# Altium schematic sheet 信号输入模块.SchDoc
size A3
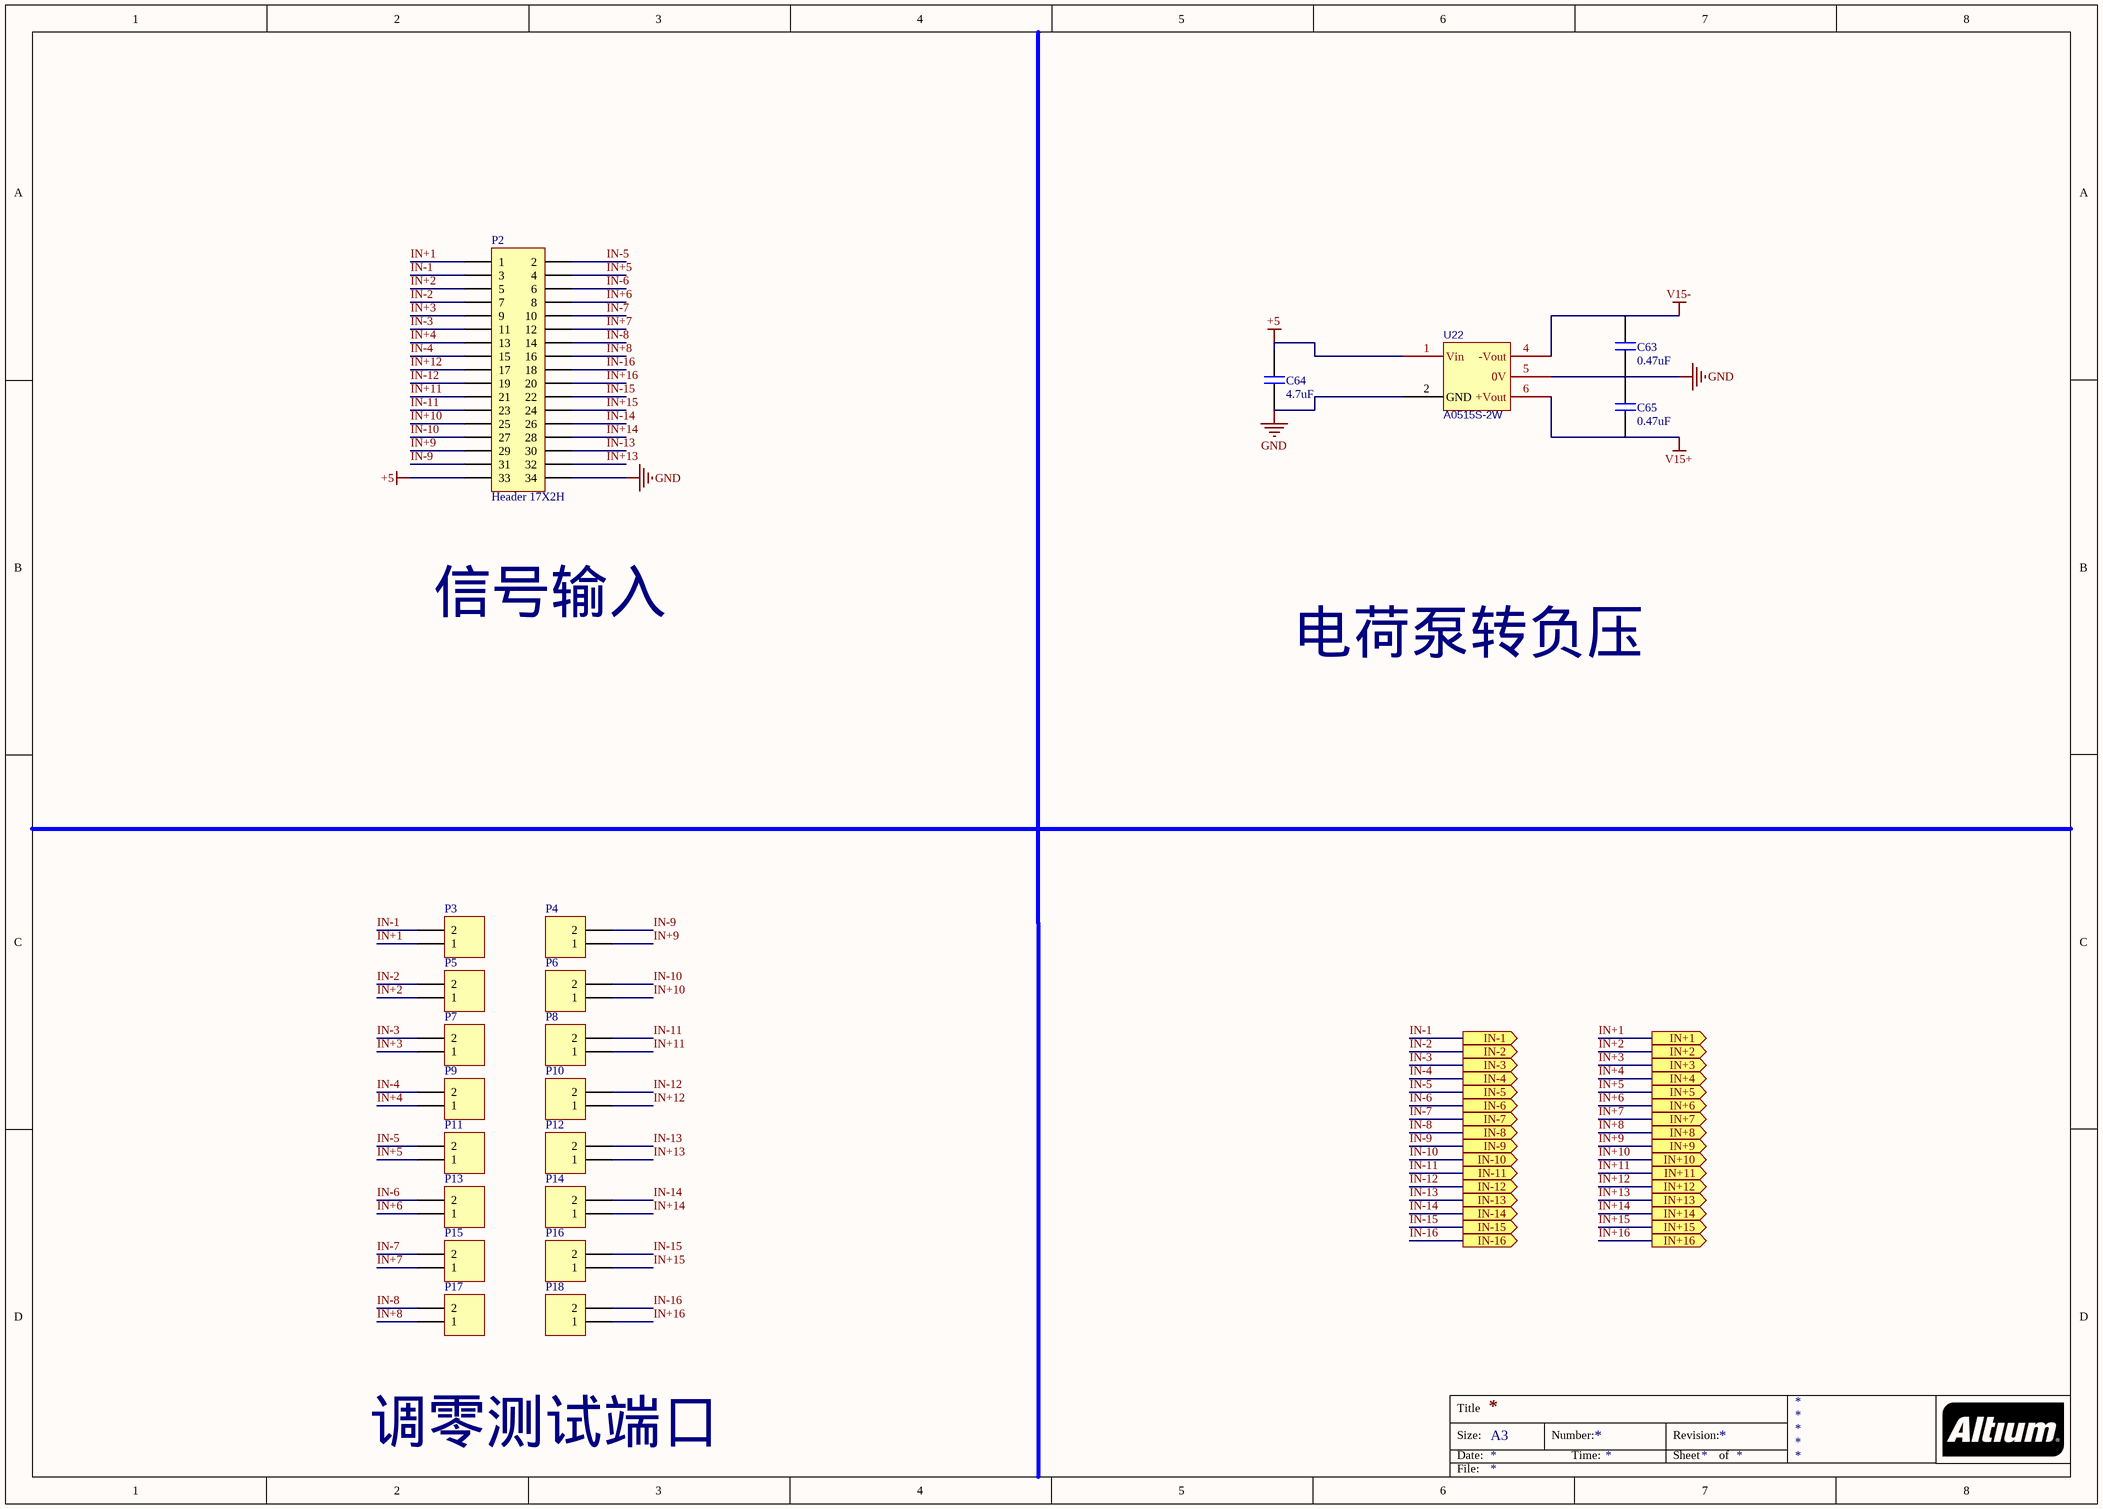
[diagram p0: 信号输入模块.SchDoc]

## Parts
C63  0.47uF  [0805C]
C64  4.7uF  [0805C]
C65  0.47uF  [0805C]
P2  Header 17X2H  [HDR2X17]
P3  Header 2H  [HDR-SMD_2P-P2.54-V-M-S4.8]  (value not drawn)
P4  Header 2H  [HDR-SMD_2P-P2.54-V-M-S4.8]  (value not drawn)
P5  Header 2H  [HDR-SMD_2P-P2.54-V-M-S4.8]  (value not drawn)
P6  Header 2H  [HDR-SMD_2P-P2.54-V-M-S4.8]  (value not drawn)
P7  Header 2H  [HDR-SMD_2P-P2.54-V-M-S4.8]  (value not drawn)
P8  Header 2H  [HDR-SMD_2P-P2.54-V-M-S4.8]  (value not drawn)
P9  Header 2H  [HDR-SMD_2P-P2.54-V-M-S4.8]  (value not drawn)
P10  Header 2H  [HDR-SMD_2P-P2.54-V-M-S4.8]  (value not drawn)
P11  Header 2H  [HDR-SMD_2P-P2.54-V-M-S4.8]  (value not drawn)
P12  Header 2H  [HDR-SMD_2P-P2.54-V-M-S4.8]  (value not drawn)
P13  Header 2H  [HDR-SMD_2P-P2.54-V-M-S4.8]  (value not drawn)
P14  Header 2H  [HDR-SMD_2P-P2.54-V-M-S4.8]  (value not drawn)
P15  Header 2H  [HDR-SMD_2P-P2.54-V-M-S4.8]  (value not drawn)
P16  Header 2H  [HDR-SMD_2P-P2.54-V-M-S4.8]  (value not drawn)
P17  Header 2H  [HDR-SMD_2P-P2.54-V-M-S4.8]  (value not drawn)
P18  Header 2H  [HDR-SMD_2P-P2.54-V-M-S4.8]  (value not drawn)
U22  A0515S-2W  [PWRM-TH_AXXXXS-2W]

## Ports
IN+1 (out), IN+2 (out), IN+3 (out), IN+4 (out), IN+5 (out), IN+6 (out), IN+7 (out), IN+8 (out), IN+9 (out), IN+10 (out), IN+11 (out), IN+12 (out), IN+13 (out), IN+14 (out), IN+15 (out), IN+16 (out), IN-1 (out), IN-2 (out), IN-3 (out), IN-4 (out), IN-5 (out), IN-6 (out), IN-7 (out), IN-8 (out), IN-9 (out), IN-10 (out), IN-11 (out), IN-12 (out), IN-13 (out), IN-14 (out), IN-15 (out), IN-16 (out)

## Nets
+5: C64.2 P2.33 U22.1(Vin)
GND: C63.1 C64.1 C65.2 P2.34 U22.2(GND) U22.5(0V)
V15+: C65.1 U22.6(+Vout)
V15-: C63.2 U22.4(-Vout)
IN+1: P2.1 P3.1 ; port IN+1
IN+2: P2.5 P5.1 ; port IN+2
IN+3: P2.9 P7.1 ; port IN+3
IN+4: P2.13 P9.1 ; port IN+4
IN+5: P2.4 P11.1 ; port IN+5
IN+6: P2.8 P13.1 ; port IN+6
IN+7: P2.12 P15.1 ; port IN+7
IN+8: P2.16 P17.1 ; port IN+8
IN+9: P2.29 P4.1 ; port IN+9
IN+10: P2.25 P6.1 ; port IN+10
IN+11: P2.21 P8.1 ; port IN+11
IN+12: P2.17 P10.1 ; port IN+12
IN+13: P2.32 P12.1 ; port IN+13
IN+14: P2.28 P14.1 ; port IN+14
IN+15: P2.24 P16.1 ; port IN+15
IN+16: P2.20 P18.1 ; port IN+16
IN-1: P2.3 P3.2 ; port IN-1
IN-2: P2.7 P5.2 ; port IN-2
IN-3: P2.11 P7.2 ; port IN-3
IN-4: P2.15 P9.2 ; port IN-4
IN-5: P2.2 P11.2 ; port IN-5
IN-6: P2.6 P13.2 ; port IN-6
IN-7: P2.10 P15.2 ; port IN-7
IN-8: P2.14 P17.2 ; port IN-8
IN-9: P2.31 P4.2 ; port IN-9
IN-10: P2.27 P6.2 ; port IN-10
IN-11: P2.23 P8.2 ; port IN-11
IN-12: P2.19 P10.2 ; port IN-12
IN-13: P2.30 P12.2 ; port IN-13
IN-14: P2.26 P14.2 ; port IN-14
IN-15: P2.22 P16.2 ; port IN-15
IN-16: P2.18 P18.2 ; port IN-16

## Notes on the sheet
- 信号输入
- 电荷泵转负压
- 调零测试端口
- Title
- Size:
- Date:
- A3
- Number:
- Time:
- Revision:
- Sheet
- of
- File:

## Library data of the parts
C63-C65 = CAP: 普通电容
P2 = Header 17X2H: Header, 17-Pin, Dual row, Right Angle; LatestRevisionDate: 17-Jul-2002; LatestRevisionNote: Re-released for DXP Platform.; Publisher: Altium Limited
P3-P18 = Header 2H: Header, 2-Pin, Right Angle; LatestRevisionDate: 17-Jul-2002; LatestRevisionNote: Re-released for DXP Platform.; Publisher: Altium Limited
U22 = A0515S-2W: 5V升15V DC-DC; BOM_Manufacturer: JETEKPS; Contributor: LCSC; BOM_Supplier: LCSC; BOM_Supplier Part: C442557; BOM_Manufacturer Part: A0515S-2W; BOM_JLCPCB Part Class: Extended Part; spicePre: U; spiceSymbolName: A0515S-2W